# Altium project USBHUB3.0.PrjPcb
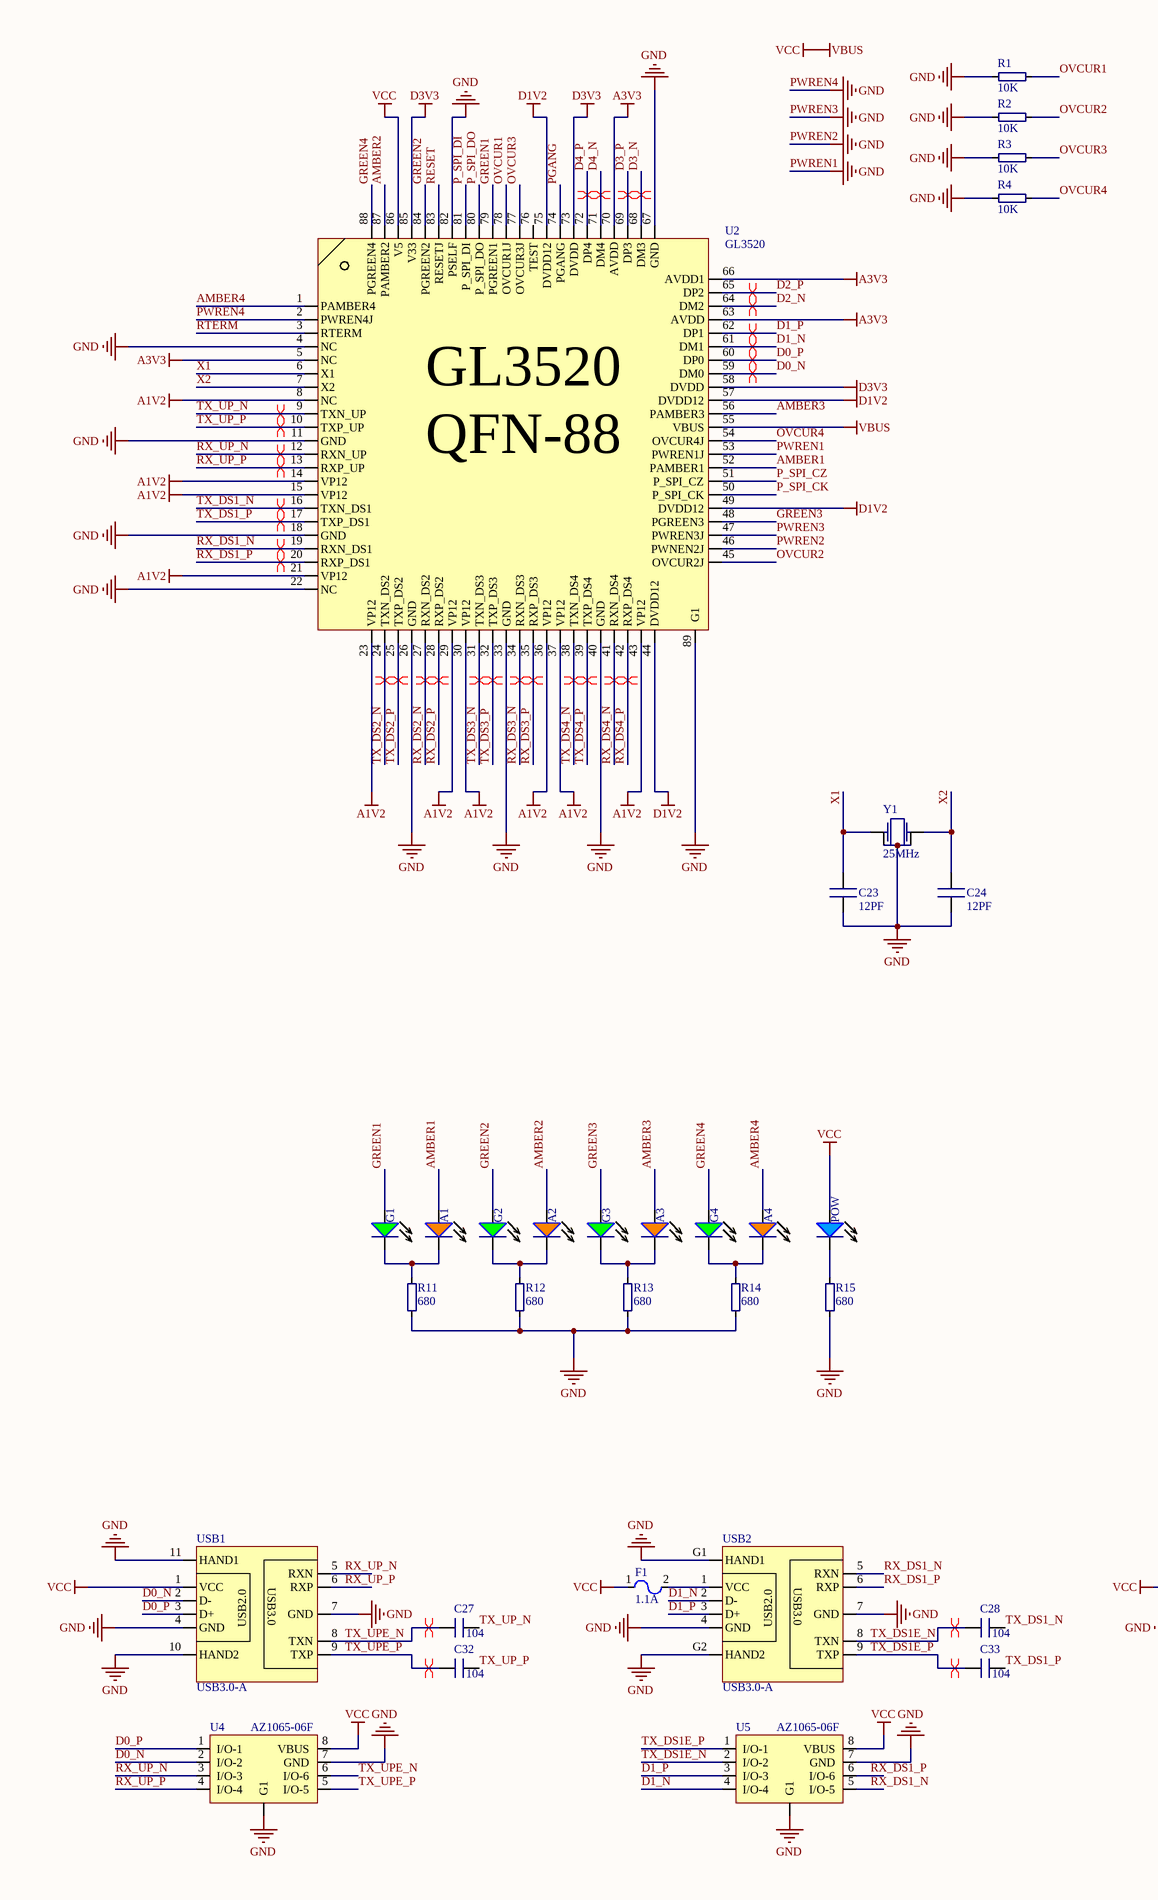
[diagram p0: GL3520.SchDoc, left]
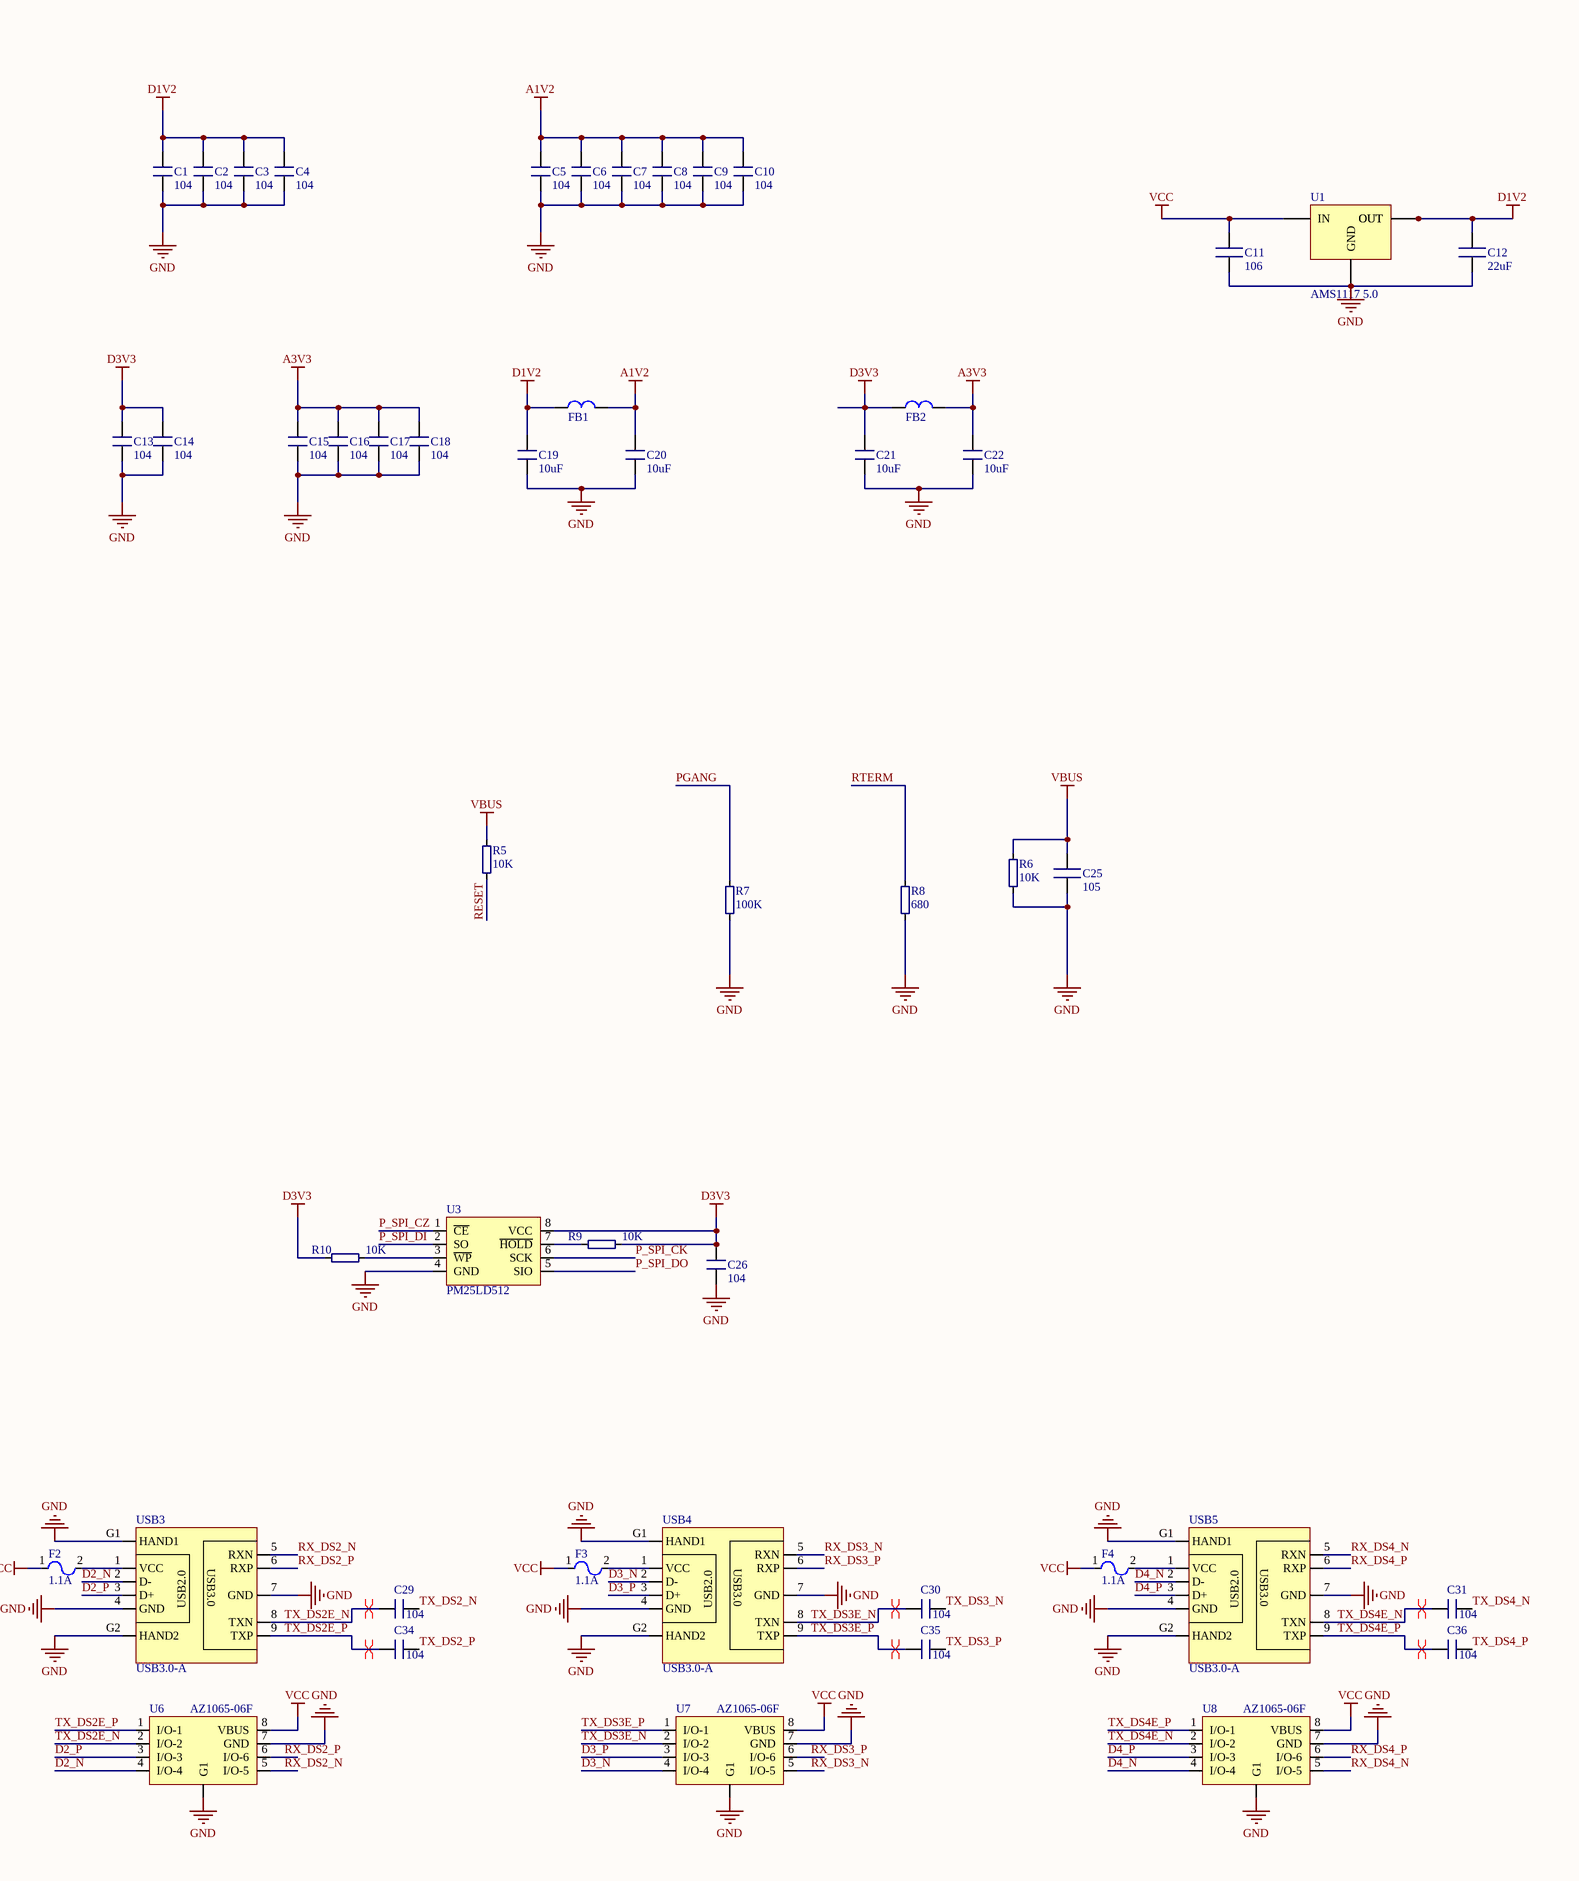
[diagram p1: GL3520.SchDoc, right]
1 sheet, 80 parts. Net scope: global (net labels, ports and power ports of the same name join across sheets).
Board file: GL3520.PcbDoc

## Sheet GL3520.SchDoc
size A2

### Parts
A1  SMD-LED_Orige  [SMD-LED-0805Y]  (value not drawn)
A2  SMD-LED_Orige  [SMD-LED-0805Y]  (value not drawn)
A3  SMD-LED_Orige  [SMD-LED-0805Y]  (value not drawn)
A4  SMD-LED_Orige  [SMD-LED-0805Y]  (value not drawn)
C1  104  [SMD-C-0201]
C2  104  [SMD-C-0201]
C3  104  [SMD-C-0201]
C4  104  [SMD-C-0201]
C5  104  [SMD-C-0201]
C6  104  [SMD-C-0201]
C7  104  [SMD-C-0201]
C8  104  [SMD-C-0201]
C9  104  [SMD-C-0201]
C10  104  [SMD-C-0201]
C11  value 106  [SMD-C-0805]  (hidden comment: SMD-C-0805)
C12  value 22uF  [SMD-C-0805]  (hidden comment: SMD-C-0805)
C13  104  [SMD-C-0201]
C14  104  [SMD-C-0201]
C15  104  [SMD-C-0201]
C16  104  [SMD-C-0201]
C17  104  [SMD-C-0201]
C18  104  [SMD-C-0201]
C19  10uF  [SMD-C-0805]
C20  10uF  [SMD-C-0805]
C21  10uF  [SMD-C-0805]
C22  10uF  [SMD-C-0805]
C23  value 12PF  [SMD-C-0805]  (hidden comment: SMD-C-0805)
C24  value 12PF  [SMD-C-0805]  (hidden comment: SMD-C-0805)
C25  value 105  [SMD-C-0805]  (hidden comment: SMD-C-0805)
C26  104  [SMD-C-0805]
C27  104  [SMD-C-0201]
C28  104  [SMD-C-0201]
C29  104  [SMD-C-0201]
C30  104  [SMD-C-0201]
C31  104  [SMD-C-0201]
C32  104  [SMD-C-0201]
C33  104  [SMD-C-0201]
C34  104  [SMD-C-0201]
C35  104  [SMD-C-0201]
C36  104  [SMD-C-0201]
F1  1.1A  [SMD-F-0805]
F2  1.1A  [SMD-F-0805]
F3  1.1A  [SMD-F-0805]
F4  1.1A  [SMD-F-0805]
FB1  XXuH  [SMD-L-0805]  (value not drawn)
FB2  XXuH  [SMD-L-0805]  (value not drawn)
G1  SMD-LED_Green  [SMD-LED-0805G]  (value not drawn)
G2  SMD-LED_Green  [SMD-LED-0805G]  (value not drawn)
G3  SMD-LED_Green  [SMD-LED-0805G]  (value not drawn)
G4  SMD-LED_Green  [SMD-LED-0805G]  (value not drawn)
POW  SMD-LED_Blue  [SMD-LED-0805B]  (value not drawn)
R1  10K  [SMD-R-0805]
R2  10K  [SMD-R-0805]
R3  10K  [SMD-R-0805]
R4  10K  [SMD-R-0805]
R5  10K  [SMD-R-0805]
R6  10K  [SMD-R-0805]
R7  100K  [SMD-R-0805]
R8  680  [SMD-R-0805]
R9  10K  [SMD-R-0805]
R10  10K  [SMD-R-0805]
R11  680  [SMD-R-0805]
R12  680  [SMD-R-0805]
R13  680  [SMD-R-0805]
R14  680  [SMD-R-0805]
R15  680  [SMD-R-0805]
U1  AMS1117 5.0  [SOT-223]
U2  GL3520  [SMD-QFN88]
U3  PM25LD512  [SMD-SOP8]
U4  AZ1065-06F  [SMD-U-DFN4120P10E]
U5  AZ1065-06F  [SMD-U-DFN4120P10E]
U6  AZ1065-06F  [SMD-U-DFN4120P10E]
U7  AZ1065-06F  [SMD-U-DFN4120P10E]
U8  AZ1065-06F  [SMD-U-DFN4120P10E]
USB1  USB3.0-A  [DIP-USB3.0-AF90]
USB2  USB3.0-A  [DIP-USB3.0-M-LI]
USB3  USB3.0-A  [DIP-USB3.0-M-LI]
USB4  USB3.0-A  [DIP-USB3.0-M-LI]
USB5  USB3.0-A  [DIP-USB3.0-M-LI]
Y1  value 25MHz  [SMD-XTAL-3225]  (hidden comment: SMT-XTAL-3225)

### Nets
A1V2: C5.2 C6.2 C7.2 C8.2 C9.2 C10.2 C20.2 FB1.1 U2.8(NC) U2.14(VP12) U2.15(VP12) U2.21(VP12) U2.23(VP12) U2.29(VP12) U2.30(VP12) U2.36(VP12) U2.37(VP12) U2.43(VP12)
A3V3: C15.2 C16.2 C17.2 C18.2 C22.2 FB2.1 U2.5(NC) U2.63(AVDD) U2.66(AVDD1) U2.70(AVDD)
D1V2: C1.2 C2.2 C3.2 C4.2 C12.2 C19.2 FB1.2 U1.0(OUT) U1.2(OUT) U2.44(DVDD12) U2.49(DVDD12) U2.57(DVDD12) U2.75(DVDD12)
D3V3: C13.2 C14.2 C21.2 C26.2 FB2.2 R9.2 R10.1 U2.58(DVDD) U2.73(DVDD) U2.85(V33) U3.8(VCC)
PWREN1: C1.1 C2.1 C3.1 C4.1 C5.1 C6.1 C7.1 C8.1 C9.1 C10.1 C11.1 C12.1 C13.1 C14.1 C15.1 C16.1 C17.1 C18.1 C19.1 C20.1 C21.1 C22.1 C23.1 C24.1 C25.1 C26.1 R1.1 R2.1 R3.1 R4.1 R6.1 R7.1 R8.1 R11.1 R12.1 R13.1 R14.1 R15.1 U1.1(GND) U2.2(PWREN4J) U2.4(NC) U2.11(GND) U2.18(GND) U2.22(NC) U2.26(GND) U2.33(GND) U2.40(GND) U2.46(PWNEN2J) U2.47(PWREN3J) U2.53(PWREN1J) U2.67(GND) U2.82(PSELF) U2.89(G1) U3.4(GND) U4.7(GND) U4.11(G1) U5.7(GND) U5.11(G1) U6.7(GND) U6.11(G1) U7.7(GND) U7.11(G1) U8.7(GND) U8.11(G1) USB1.4(GND) USB1.7(GND) USB1.10(HAND2) USB1.11(HAND1) USB2.4(GND) USB2.7(GND) USB2.G1(HAND1) USB2.G2(HAND2) USB3.4(GND) USB3.7(GND) USB3.G1(HAND1) USB3.G2(HAND2) USB4.4(GND) USB4.7(GND) USB4.G1(HAND1) USB4.G2(HAND2) USB5.4(GND) USB5.7(GND) USB5.G1(HAND1) USB5.G2(HAND2) Y1.2 Y1.4  [also labelled GND, PWREN2, PWREN3, PWREN4]
VBUS: C11.2 C25.2 F1.1 F2.1 F3.1 F4.1 POW.1 R5.2 R6.2 U1.3(IN) U2.55(VBUS) U2.86(V5) U4.8(VBUS) U5.8(VBUS) U6.8(VBUS) U7.8(VBUS) U8.8(VBUS) USB1.1(VCC)  [also labelled VCC]
AMBER1: A1.1 U2.52(PAMBER1)
AMBER2: A2.1 U2.87(PAMBER2)
AMBER3: A3.1 U2.56(PAMBER3)
AMBER4: A4.1 U2.1(PAMBER4)
D0_N: U2.59(DM0) U4.2(I/O-2) USB1.2(D-)
D0_P: U2.60(DP0) U4.1(I/O-1) USB1.3(D+)
D1_N: U2.61(DM1) U5.4(I/O-4) USB2.2(D-)
D1_P: U2.62(DP1) U5.3(I/O-3) USB2.3(D+)
D2_N: U2.64(DM2) U6.4(I/O-4) USB3.2(D-)
D2_P: U2.65(DP2) U6.3(I/O-3) USB3.3(D+)
D3_N: U2.68(DM3) U7.4(I/O-4) USB4.2(D-)
D3_P: U2.69(DP3) U7.3(I/O-3) USB4.3(D+)
D4_N: U2.71(DM4) U8.4(I/O-4) USB5.2(D-)
D4_P: U2.72(DP4) U8.3(I/O-3) USB5.3(D+)
GREEN1: G1.1 U2.79(PGREEN1)
GREEN2: G2.1 U2.84(PGREEN2)
GREEN3: G3.1 U2.48(PGREEN3)
GREEN4: G4.1 U2.88(PGREEN4)
OVCUR1: R1.2 U2.78(OVCUR1J)
OVCUR2: R2.2 U2.45(OVCUR2J)
OVCUR3: R3.2 U2.77(OVCUR3J)
OVCUR4: R4.2 U2.54(OVCUR4J)
P_SPI_CK: U2.50(P_SPI_CK) U3.6(SCK)
P_SPI_CZ: U2.51(P_SPI_CZ) U3.1(~{CE})
P_SPI_DI: U2.81(P_SPI_DI) U3.2(SO)
P_SPI_DO: U2.80(P_SPI_DO) U3.5(SIO)
PGANG: R7.2 U2.74(PGANG)
RESET: R5.1 U2.83(RESETJ)
RTERM: R8.2 U2.3(RTERM)
RX_DS1_N: U2.19(RXN_DS1) U5.5(I/O-5) USB2.5(RXN)
RX_DS1_P: U2.20(RXP_DS1) U5.6(I/O-6) USB2.6(RXP)
RX_DS2_N: U2.27(RXN_DS2) U6.5(I/O-5) USB3.5(RXN)
RX_DS2_P: U2.28(RXP_DS2) U6.6(I/O-6) USB3.6(RXP)
RX_DS3_N: U2.34(RXN_DS3) U7.5(I/O-5) USB4.5(RXN)
RX_DS3_P: U2.35(RXP_DS3) U7.6(I/O-6) USB4.6(RXP)
RX_DS4_N: U2.41(RXN_DS4) U8.5(I/O-5) USB5.5(RXN)
RX_DS4_P: U2.42(RXP_DS4) U8.6(I/O-6) USB5.6(RXP)
RX_UP_N: U2.12(RXN_UP) U4.3(I/O-3) USB1.5(RXN)
RX_UP_P: U2.13(RXP_UP) U4.4(I/O-4) USB1.6(RXP)
TX_DS1_N: C28.2 U2.16(TXN_DS1)
TX_DS1_P: C33.2 U2.17(TXP_DS1)
TX_DS1E_N: C28.1 U5.2(I/O-2) USB2.8(TXN)
TX_DS1E_P: C33.1 U5.1(I/O-1) USB2.9(TXP)
TX_DS2_N: C29.2 U2.24(TXN_DS2)
TX_DS2_P: C34.2 U2.25(TXP_DS2)
TX_DS2E_N: C29.1 U6.2(I/O-2) USB3.8(TXN)
TX_DS2E_P: C34.1 U6.1(I/O-1) USB3.9(TXP)
TX_DS3_N: C30.2 U2.31(TXN_DS3)
TX_DS3_P: C35.2 U2.32(TXP_DS3)
TX_DS3E_N: C30.1 U7.2(I/O-2) USB4.8(TXN)
TX_DS3E_P: C35.1 U7.1(I/O-1) USB4.9(TXP)
TX_DS4_N: C31.2 U2.38(TXN_DS4)
TX_DS4_P: C36.2 U2.39(TXP_DS4)
TX_DS4E_N: C31.1 U8.2(I/O-2) USB5.8(TXN)
TX_DS4E_P: C36.1 U8.1(I/O-1) USB5.9(TXP)
TX_UP_N: C27.2 U2.9(TXN_UP)
TX_UP_P: C32.2 U2.10(TXP_UP)
TX_UPE_N: C27.1 U4.6(I/O-6) USB1.8(TXN)
TX_UPE_P: C32.1 U4.5(I/O-5) USB1.9(TXP)
X1: C23.2 U2.6(X1) Y1.1
X2: C24.2 U2.7(X2) Y1.3
NetA1_2: A1.2 G1.2 R11.2
NetA2_2: A2.2 G2.2 R12.2
NetA3_2: A3.2 G3.2 R13.2
NetA4_2: A4.2 G4.2 R14.2
NetF1_2: F1.2 USB2.1(VCC)
NetF2_2: F2.2 USB3.1(VCC)
NetF3_2: F3.2 USB4.1(VCC)
NetF4_2: F4.2 USB5.1(VCC)
NetPOW_2: POW.2 R15.2
NetR9_1: R9.1 U3.7(~{HOLD})
NetR10_2: R10.2 U3.3(~{WP})

Not connected (* = marked no-connect by the designer): U2 76(TEST)

### Layout directives
differential pair: D0_N, D0_P, D1_N, D1_P, D2_N, D2_P, D3_N, D3_P, D4_N, D4_P, RX_DS1_N, RX_DS1_P, RX_DS2_N, RX_DS2_P, RX_DS3_N, RX_DS3_P, RX_DS4_N, RX_DS4_P, RX_UP_N, RX_UP_P, TX_DS1_N, TX_DS1_P, TX_DS1E_N, TX_DS1E_P, TX_DS2_N, TX_DS2_P, TX_DS2E_N, TX_DS2E_P, TX_DS3_N, TX_DS3_P, TX_DS3E_N, TX_DS3E_P, TX_DS4_N, TX_DS4_P, TX_DS4E_N, TX_DS4E_P, TX_UP_N, TX_UP_P, TX_UPE_N, TX_UPE_P

### Notes on the sheet
- (in symbol DIP-USB3.0) USB3.0; USB2.0
- (in symbol DIP-USB3.-AF90) USB3.0; USB2.0
- (in symbol SMD-IC-GL3520-QFN88) QFN-88

### Library data of the parts
C1-C10 C13-C18 C27-C36 = SMD-C-0201
C19-C22 C26 = SMD-C-0805: 贴片瓷片电容; Value: XXpF
F1-F4 = SMD-F-0805: 保险丝贴片自恢复
FB1 FB2 = SMD-L-0805: 磁珠
R1-R15 = SMD-R-0805: Value: ??K
U1 = SMD-IC-AMS1117
U2 = SMD-IC-GL3520-QFN88: USB3.0 HUB controller
U3 = SMD-IC-PM25LD512: flash芯片
U4-U8 = SMD-IC-AZ1065-06F: TVS阵列保护
USB1 = DIP-USB3.-AF90
USB2-USB5 = DIP-USB3.0
Y1 = SMT-XTAL-3225: 晶振